# EAGLE schematic kulgurpower2-unrouted (EAGLE 6.3)

## Sheet 1 of 6
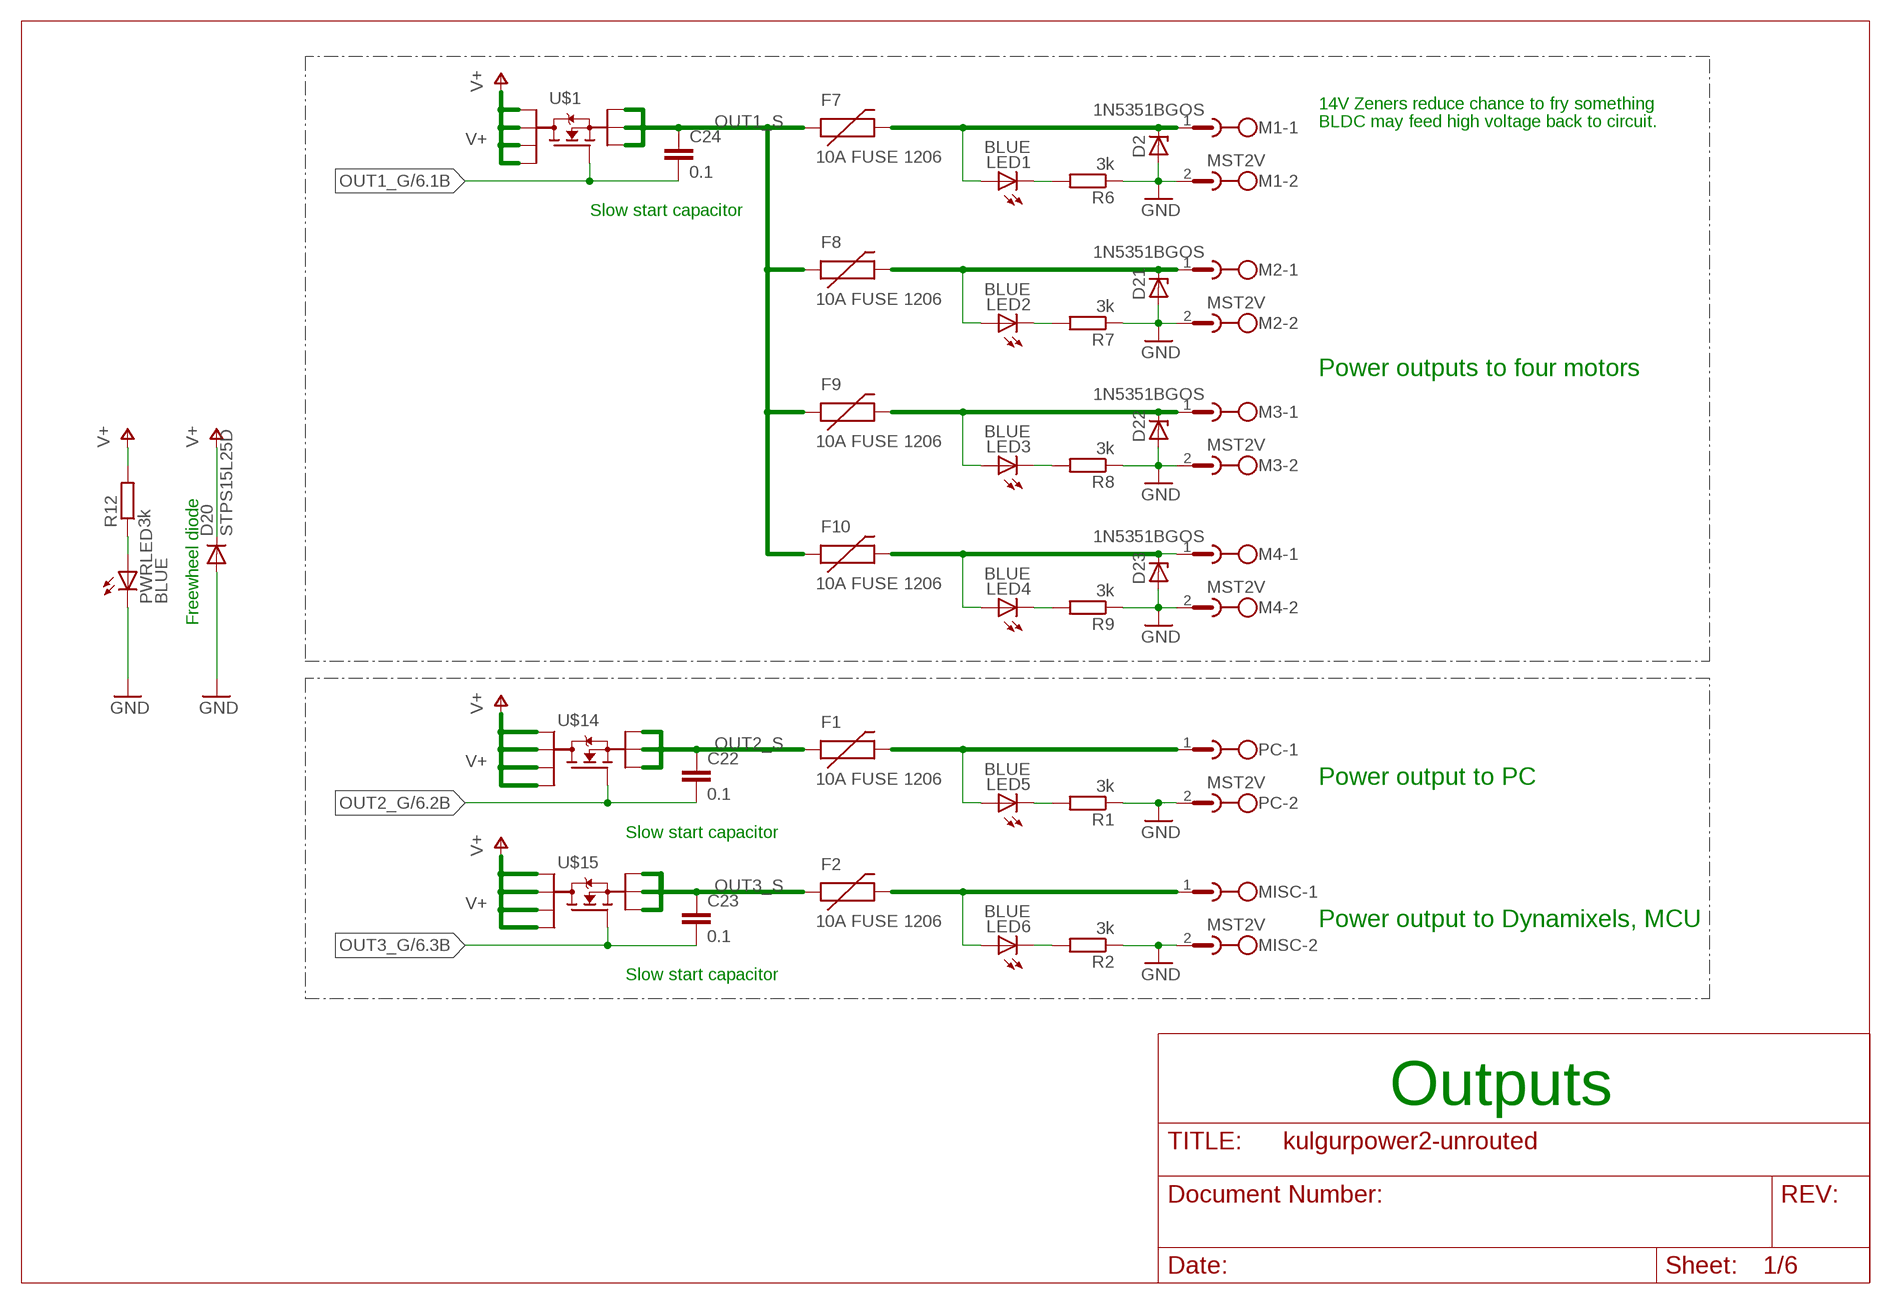
[diagram p0: schematic, sheet 1]

### Parts
C22  0.1  C-EUC0603  [C0603]
C23  0.1  C-EUC0603  [C0603]
C24  0.1  C-EUC0603  [C0603]
D2  1N5351BGOS  1N5333  [C1702-15]
D20  STPS15L25D  DIODE-C221B1A  [C221B1A]
D21  1N5351BGOS  1N5333  [C1702-15]
D22  1N5351BGOS  1N5333  [C1702-15]
D23  1N5351BGOS  1N5333  [C1702-15]
F1  10A FUSE 1206  PTCSMD  [PTC-1206]
F2  10A FUSE 1206  PTCSMD  [PTC-1206]
F7  10A FUSE 1206  PTCSMD  [PTC-1206]
F8  10A FUSE 1206  PTCSMD  [PTC-1206]
F9  10A FUSE 1206  PTCSMD  [PTC-1206]
F10  10A FUSE 1206  PTCSMD  [PTC-1206]
LED1  BLUE  LEDCHIP-LED0603  [CHIP-LED0603]
LED2  BLUE  LEDCHIP-LED0603  [CHIP-LED0603]
LED3  BLUE  LEDCHIP-LED0603  [CHIP-LED0603]
LED4  BLUE  LEDCHIP-LED0603  [CHIP-LED0603]
LED5  BLUE  LEDCHIP-LED0603  [CHIP-LED0603]
LED6  BLUE  LEDCHIP-LED0603  [CHIP-LED0603]
M1  MST2V  [MSTBV2]
M2  MST2V  [MSTBV2]
M3  MST2V  [MSTBV2]
M4  MST2V  [MSTBV2]
MISC  MST2V  [MSTBV2]
PC  MST2V  [MSTBV2]
PWRLED  BLUE  LEDCHIP-LED0603  [CHIP-LED0603]
R1  3k  R-EU_R0603  [R0603]
R2  3k  R-EU_R0603  [R0603]
R6  3k  R-EU_R0603  [R0603]
R7  3k  R-EU_R0603  [R0603]
R8  3k  R-EU_R0603  [R0603]
R9  3k  R-EU_R0603  [R0603]
R12  3k  R-EU_R0603  [R0603]
U$1  AON6500  FDMS8558S  [POWER56]
U$14  AON6500  FDMS8558S  [POWER56]
U$15  AON6500  FDMS8558S  [POWER56]

### Nets
GND: D2.A D20.A D21.A D22.A D23.A M1.2 M2.2 M3.2 M4.2 MISC.2 PC.2 PWRLED.C R1.1 R2.1 R6.1 R7.1 R8.1 R9.1 ; also sheet 2,3,4,5,6
N$1 [morepower]: LED1.C R6.2
N$4 [morepower]: LED2.C R7.2
N$7 [morepower]: LED3.C R8.2
N$9 [morepower]: LED4.C R9.2
N$15 [morepower]: LED5.C R1.2
N$17 [morepower]: LED6.C R2.2
N$19 [morepower]: PWRLED.A R12.1
OUT1_G [power]: C24.2 U$1.P$4(G) ; also sheet 6
OUT1_S [morepower]: C24.1 F7.1 F8.1 F9.1 F10.1 U$1.P$1(S1) U$1.P$2(S2) U$1.P$3(S3) ; also sheet 6
OUT2_G [power]: C22.2 U$14.P$4(G) ; also sheet 6
OUT2_S [morepower]: C22.1 F1.1 U$14.P$1(S1) U$14.P$2(S2) U$14.P$3(S3) ; also sheet 6
OUT3_G [power]: C23.2 U$15.P$4(G) ; also sheet 6
OUT3_S [morepower]: C23.1 F2.1 U$15.P$1(S1) U$15.P$2(S2) U$15.P$3(S3) ; also sheet 6
PWR1 [morepower]: D2.C F7.2 LED1.A M1.1
PWR2 [morepower]: D21.C F8.2 LED2.A M2.1
PWR3 [morepower]: D22.C F9.2 LED3.A M3.1
PWR4 [morepower]: D23.C F10.2 LED4.A M4.1
PWR5 [morepower]: F1.2 LED5.A PC.1
PWR6 [morepower]: F2.2 LED6.A MISC.1
V+ [morepower]: D20.C R12.2 U$1.P$5(D4) U$1.P$6(D3) U$1.P$7(D2) U$1.P$8(D1) U$14.P$5(D4) U$14.P$6(D3) U$14.P$7(D2) U$14.P$8(D1) U$15.P$5(D4) U$15.P$6(D3) U$15.P$7(D2) U$15.P$8(D1) ; also sheet 2,4,5,6

### Notes on the sheet
- 14V Zeners reduce chance to fry something
- BLDC may feed high voltage back to circuit.
- Slow start capacitor
- Power outputs to four motors
- Freewheel diode
- Power output to PC
- Slow start capacitor
- Power output to Dynamixels, MCU
- Slow start capacitor
- Outputs

## Sheet 2 of 6
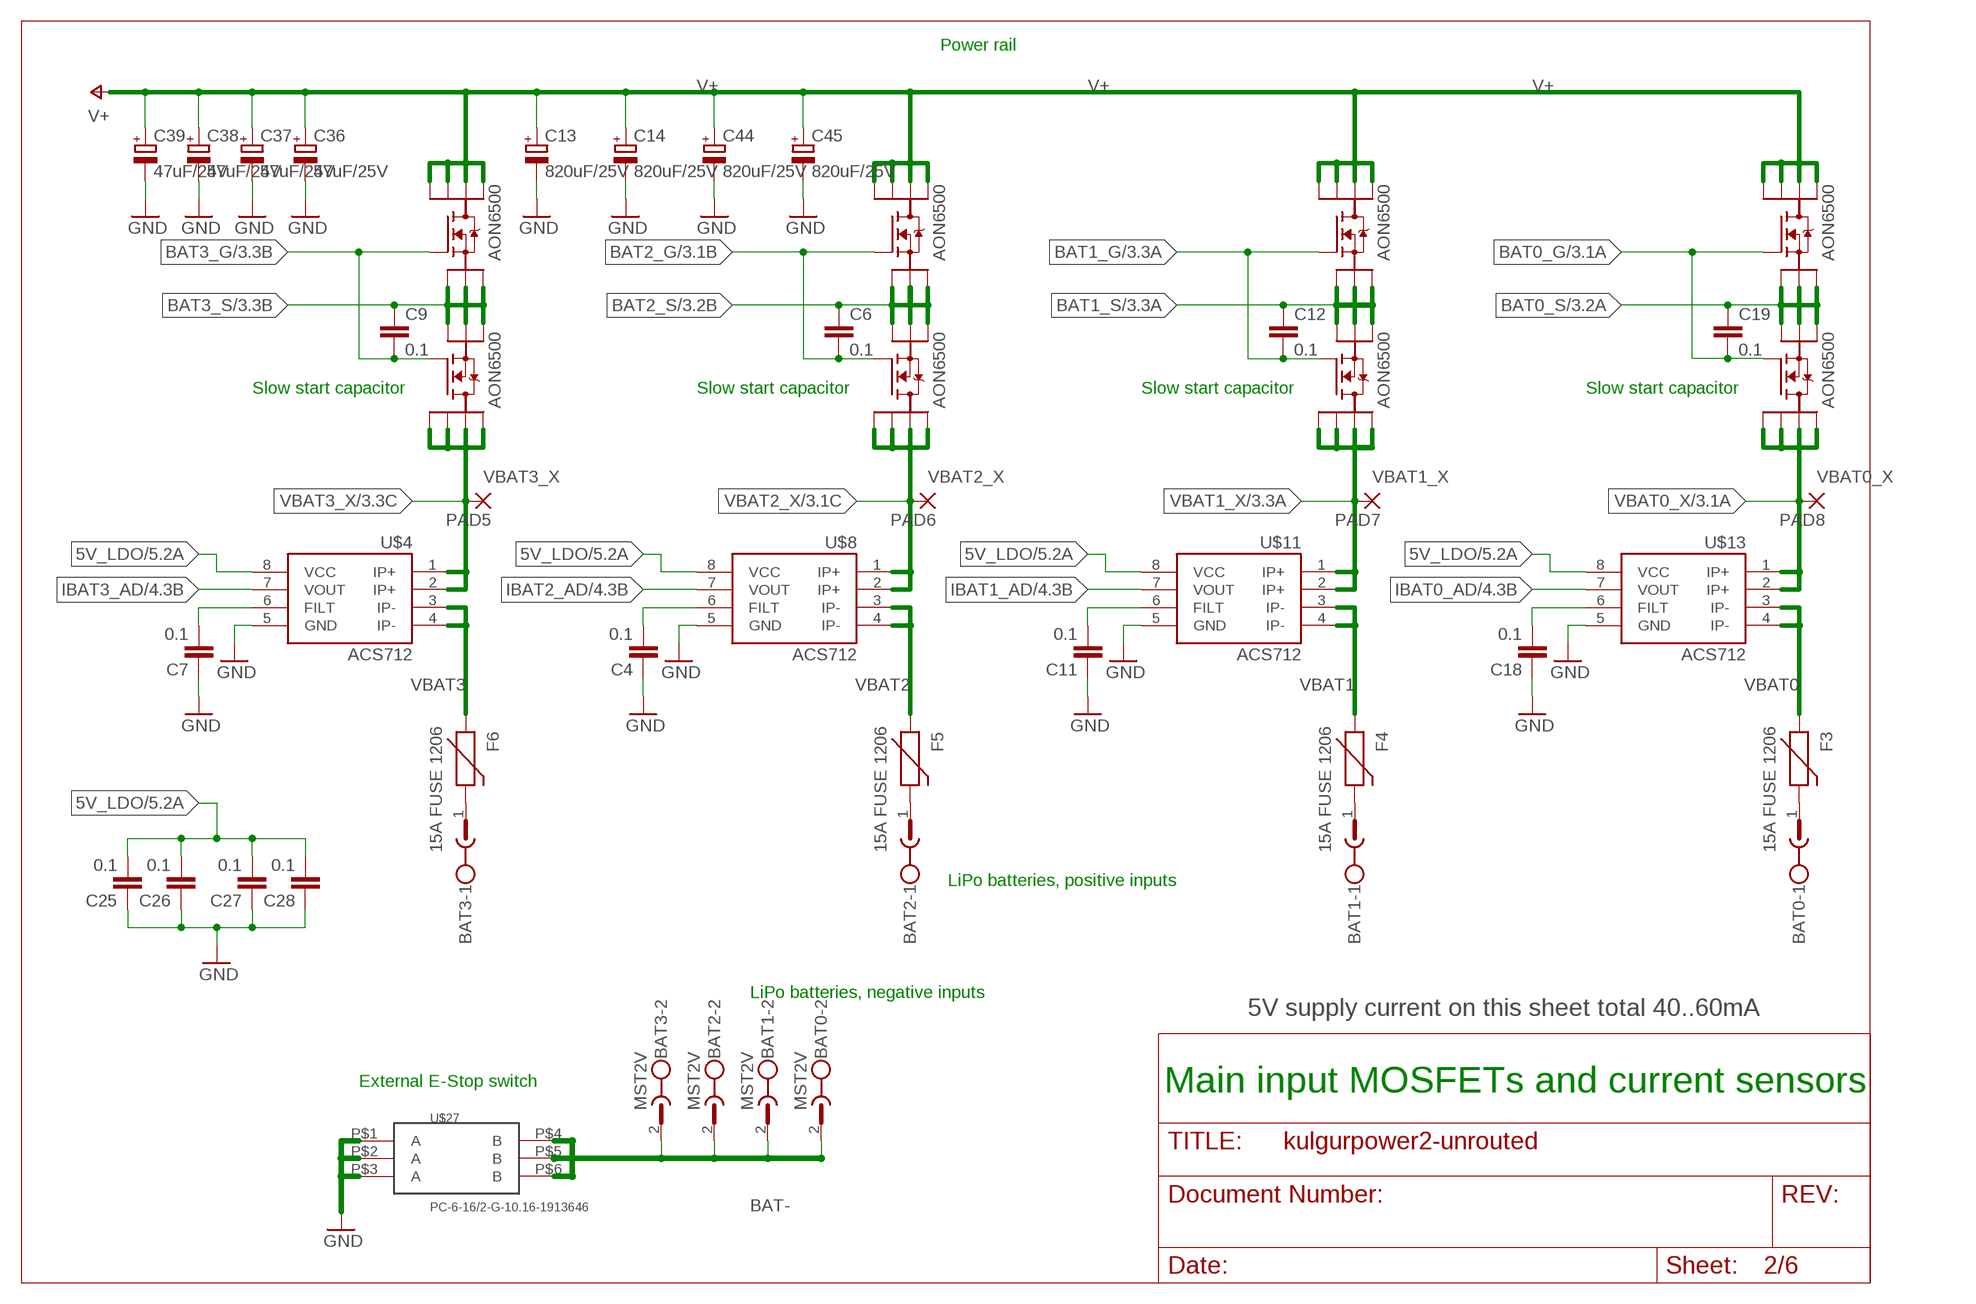
[diagram p1: schematic, sheet 2]

### Parts
BAT0  MST2V  [MSTBV2]
BAT1  MST2V  [MSTBV2]
BAT2  MST2V  [MSTBV2]
BAT3  MST2V  [MSTBV2]
C4  0.1  C-EUC0603  [C0603]
C6  0.1  C-EUC0603  [C0603]
C7  0.1  C-EUC0603  [C0603]
C9  0.1  C-EUC0603  [C0603]
C11  0.1  C-EUC0603  [C0603]
C12  0.1  C-EUC0603  [C0603]
C13  820uF/25V  CPOL-EU153CLV-1014  [153CLV-1014]
C14  820uF/25V  CPOL-EU153CLV-1014  [153CLV-1014]
C18  0.1  C-EUC0603  [C0603]
C19  0.1  C-EUC0603  [C0603]
C25  0.1  C-EUC0603  [C0603]
C26  0.1  C-EUC0603  [C0603]
C27  0.1  C-EUC0603  [C0603]
C28  0.1  C-EUC0603  [C0603]
C36  47uF/25V  CPOL-EUC/6032-28R  [C/6032-28R]
C37  47uF/25V  CPOL-EUC/6032-28R  [C/6032-28R]
C38  47uF/25V  CPOL-EU175TMP-0810  [175TMP-0810]
C39  47uF/25V  CPOL-EU175TMP-0810  [175TMP-0810]
C44  820uF/25V  CPOL-EU153CLV-1014  [153CLV-1014]
C45  820uF/25V  CPOL-EU153CLV-1014  [153CLV-1014]
F3  15A FUSE 1206  PTCSMD  [PTC-1206]
F4  15A FUSE 1206  PTCSMD  [PTC-1206]
F5  15A FUSE 1206  PTCSMD  [PTC-1206]
F6  15A FUSE 1206  PTCSMD  [PTC-1206]
PAD5  1,6/0,9  [1,6/0,9]
PAD6  1,6/0,9  [1,6/0,9]
PAD7  1,6/0,9  [1,6/0,9]
PAD8  1,6/0,9  [1,6/0,9]
U$2  AON6500  FDMS8558S  [POWER56]
U$3  AON6500  FDMS8558S  [POWER56]
U$4  ACS712  [SO08]
U$5  AON6500  FDMS8558S  [POWER56]
U$6  AON6500  FDMS8558S  [POWER56]
U$7  AON6500  FDMS8558S  [POWER56]
U$8  ACS712  [SO08]
U$9  AON6500  FDMS8558S  [POWER56]
U$10  AON6500  FDMS8558S  [POWER56]
U$11  ACS712  [SO08]
U$12  AON6500  FDMS8558S  [POWER56]
U$13  ACS712  [SO08]
U$27  PC-6-16/2-G-10.16-1913646  [PC-6-16/2-G-10.16]

### Nets
5V_LDO [power]: C25.2 C26.2 C27.2 C28.2 U$4.8(VCC) U$8.8(VCC) U$11.8(VCC) U$13.8(VCC) ; also sheet 5
BAT0_G [power]: C19.2 U$5.P$4(G) U$12.P$4(G) ; also sheet 3
BAT0_S [power]: C19.1 U$5.P$1(S1) U$5.P$2(S2) U$5.P$3(S3) U$12.P$1(S1) U$12.P$2(S2) U$12.P$3(S3) ; also sheet 3
BAT1_G [power]: C12.2 U$9.P$4(G) U$10.P$4(G) ; also sheet 3
BAT1_S [power]: C12.1 U$9.P$1(S1) U$9.P$2(S2) U$9.P$3(S3) U$10.P$1(S1) U$10.P$2(S2) U$10.P$3(S3) ; also sheet 3
BAT2_G [power]: C6.2 U$6.P$4(G) U$7.P$4(G) ; also sheet 3
BAT2_S [power]: C6.1 U$6.P$1(S1) U$6.P$2(S2) U$6.P$3(S3) U$7.P$1(S1) U$7.P$2(S2) U$7.P$3(S3) ; also sheet 3
BAT3_G [power]: C9.2 U$2.P$4(G) U$3.P$4(G) ; also sheet 3
BAT3_S [power]: C9.1 U$2.P$1(S1) U$2.P$2(S2) U$2.P$3(S3) U$3.P$1(S1) U$3.P$2(S2) U$3.P$3(S3) ; also sheet 3
BAT- [morepower]: BAT0.2 BAT1.2 BAT2.2 BAT3.2 U$27.P$4(B) U$27.P$5(B) U$27.P$6(B)
GND: C4.1 C7.1 C11.1 C13.- C14.- C18.1 C25.1 C26.1 C27.1 C28.1 C36.- C37.- C38.- C39.- C44.- C45.- U$4.5(GND) U$8.5(GND) U$11.5(GND) U$13.5(GND) U$27.P$1(A) U$27.P$2(A) U$27.P$3(A) ; also sheet 1,3,4,5,6
IBAT0_AD [power]: U$13.7(VOUT) ; also sheet 4
IBAT1_AD [power]: U$11.7(VOUT) ; also sheet 4
IBAT2_AD [power]: U$8.7(VOUT) ; also sheet 4
IBAT3_AD [power]: U$4.7(VOUT) ; also sheet 4
N$3: BAT0.1 F3.2
N$8: BAT3.1 F6.2
N$10: BAT1.1 F4.2
N$11 [power]: C4.2 U$8.6(FILT)
N$12: BAT2.1 F5.2
N$14 [power]: C11.2 U$11.6(FILT)
N$21 [power]: C7.2 U$4.6(FILT)
N$27 [power]: C18.2 U$13.6(FILT)
V+ [morepower]: C13.+ C14.+ C36.+ C37.+ C38.+ C39.+ C44.+ C45.+ U$2.P$5(D4) U$2.P$6(D3) U$2.P$7(D2) U$2.P$8(D1) U$5.P$5(D4) U$5.P$6(D3) U$5.P$7(D2) U$5.P$8(D1) U$6.P$5(D4) U$6.P$6(D3) U$6.P$7(D2) U$6.P$8(D1) U$9.P$5(D4) U$9.P$6(D3) U$9.P$7(D2) U$9.P$8(D1) ; also sheet 1,4,5,6
VBAT0 [morepower]: F3.1 U$13.3(IP-) U$13.4(IP-)
VBAT0_X [morepower]: PAD8.1(P) U$12.P$5(D4) U$12.P$6(D3) U$12.P$7(D2) U$12.P$8(D1) U$13.1(IP+) U$13.2(IP+) ; also sheet 3,4
VBAT1 [morepower]: F4.1 U$11.3(IP-) U$11.4(IP-)
VBAT1_X [morepower]: PAD7.1(P) U$10.P$5(D4) U$10.P$6(D3) U$10.P$7(D2) U$10.P$8(D1) U$11.1(IP+) U$11.2(IP+) ; also sheet 3,4
VBAT2 [morepower]: F5.1 U$8.3(IP-) U$8.4(IP-)
VBAT2_X [morepower]: PAD6.1(P) U$7.P$5(D4) U$7.P$6(D3) U$7.P$7(D2) U$7.P$8(D1) U$8.1(IP+) U$8.2(IP+) ; also sheet 3,4
VBAT3 [morepower]: F6.1 U$4.3(IP-) U$4.4(IP-)
VBAT3_X [morepower]: PAD5.1(P) U$3.P$5(D4) U$3.P$6(D3) U$3.P$7(D2) U$3.P$8(D1) U$4.1(IP+) U$4.2(IP+) ; also sheet 3,4

### Notes on the sheet
- Power rail
- Slow start capacitor | Slow start capacitor | Slow start capacitor | Slow start capacitor
- LiPo batteries, positive inputs
- LiPo batteries, negative inputs
- 5V supply current on this sheet total 40..60mA
- External E-Stop switch
- Main input MOSFETs and current sensors

## Sheet 3 of 6
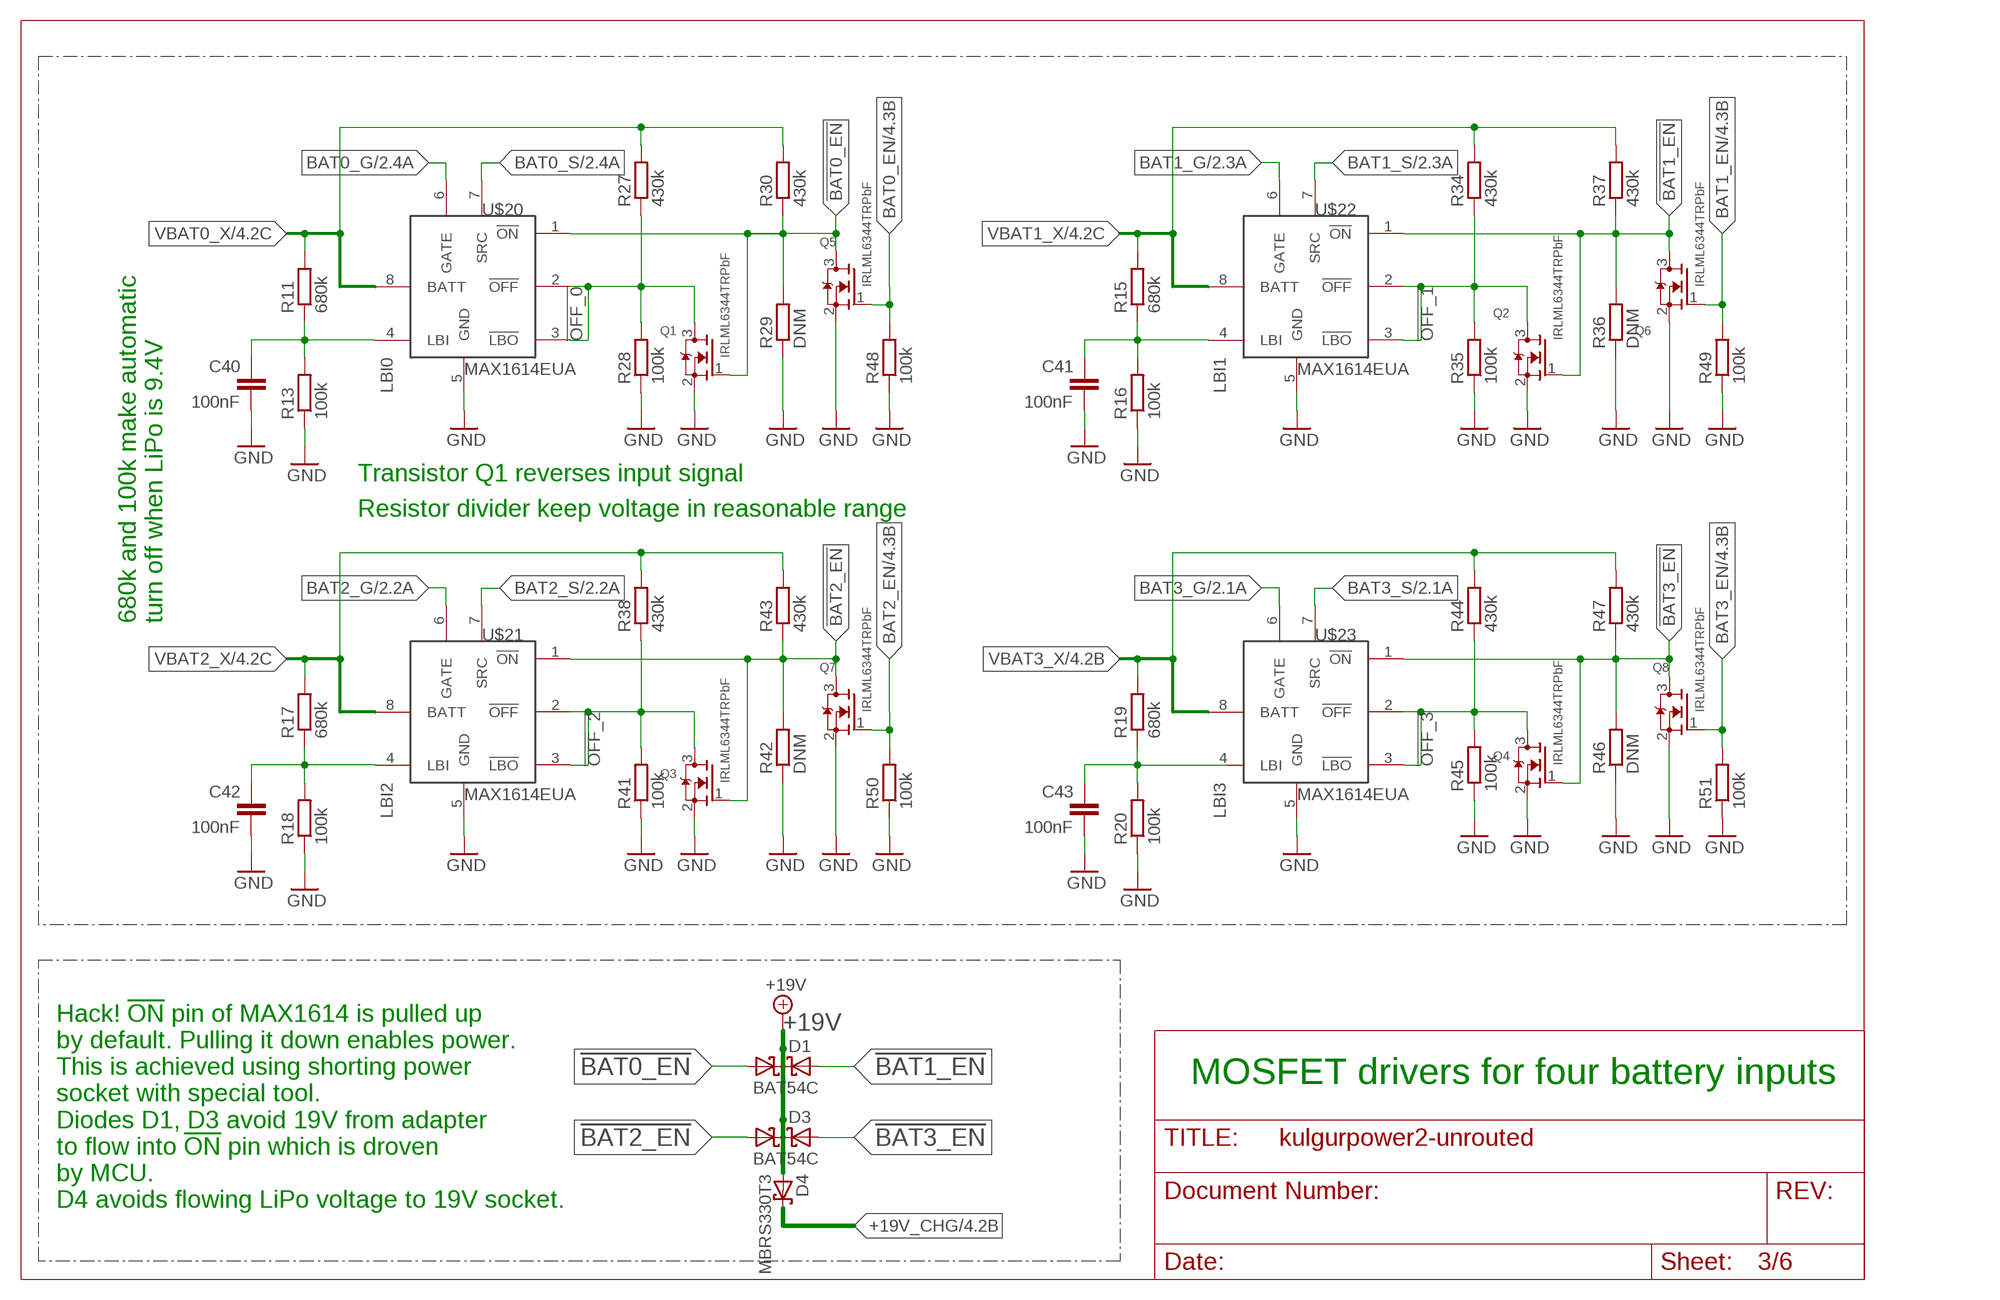
[diagram p2: schematic, sheet 3]

### Parts
C40  100nF  C-EUC0603  [C0603]
C41  100nF  C-EUC0603  [C0603]
C42  100nF  C-EUC0603  [C0603]
C43  100nF  C-EUC0603  [C0603]
D1  BAT54C  [SOT23]
D3  BAT54C  [SOT23]
D4  MBRS330T3  [SMC]
Q1  IRLML6344TRPbF  MOSFET-NREFLOW  [SOT23]
Q2  IRLML6344TRPbF  MOSFET-NREFLOW  [SOT23]
Q3  IRLML6344TRPbF  MOSFET-NREFLOW  [SOT23]
Q4  IRLML6344TRPbF  MOSFET-NREFLOW  [SOT23]
Q5  IRLML6344TRPbF  MOSFET-NREFLOW  [SOT23]
Q6  IRLML6344TRPbF  MOSFET-NREFLOW  [SOT23]
Q7  IRLML6344TRPbF  MOSFET-NREFLOW  [SOT23]
Q8  IRLML6344TRPbF  MOSFET-NREFLOW  [SOT23]
R11  680k  R-EU_R0603  [R0603]
R13  100k  R-EU_R0603  [R0603]
R15  680k  R-EU_R0603  [R0603]
R16  100k  R-EU_R0603  [R0603]
R17  680k  R-EU_R0603  [R0603]
R18  100k  R-EU_R0603  [R0603]
R19  680k  R-EU_R0603  [R0603]
R20  100k  R-EU_R0603  [R0603]
R27  430k  R-EU_R0603  [R0603]
R28  100k  R-EU_R0603  [R0603]
R29  DNM  R-EU_R0603  [R0603]
R30  430k  R-EU_R0603  [R0603]
R34  430k  R-EU_R0603  [R0603]
R35  100k  R-EU_R0603  [R0603]
R36  DNM  R-EU_R0603  [R0603]
R37  430k  R-EU_R0603  [R0603]
R38  430k  R-EU_R0603  [R0603]
R41  100k  R-EU_R0603  [R0603]
R42  DNM  R-EU_R0603  [R0603]
R43  430k  R-EU_R0603  [R0603]
R44  430k  R-EU_R0603  [R0603]
R45  100k  R-EU_R0603  [R0603]
R46  DNM  R-EU_R0603  [R0603]
R47  430k  R-EU_R0603  [R0603]
R48  100k  R-EU_R0603  [R0603]
R49  100k  R-EU_R0603  [R0603]
R50  100k  R-EU_R0603  [R0603]
R51  100k  R-EU_R0603  [R0603]
U$20  MAX1614EUA  [MAX1614EUA]
U$21  MAX1614EUA  [MAX1614EUA]
U$22  MAX1614EUA  [MAX1614EUA]
U$23  MAX1614EUA  [MAX1614EUA]

### Nets
!BAT0_EN [power]: D1.1(A1) Q1.1(G) Q5.3(D) R29.2 R30.1 U$20.1(!ON)
!BAT1_EN [power]: D1.2(A2) Q2.1(G) Q6.3(D) R36.2 R37.1 U$22.1(!ON)
!BAT2_EN [power]: D3.1(A1) Q3.1(G) Q7.3(D) R42.2 R43.1 U$21.1(!ON)
!BAT3_EN [power]: D3.2(A2) Q4.1(G) Q8.3(D) R46.2 R47.1 U$23.1(!ON)
!OFF_0 [morepower]: Q1.3(D) R27.1 R28.2 U$20.2(!OFF) U$20.3(!LBO)
!OFF_1 [morepower]: Q2.3(D) R34.1 R35.2 U$22.2(!OFF) U$22.3(!LBO)
!OFF_2 [morepower]: Q3.3(D) R38.1 R41.2 U$21.2(!OFF) U$21.3(!LBO)
!OFF_3 [morepower]: Q4.3(D) R44.1 R45.2 U$23.2(!OFF) U$23.3(!LBO)
+19V [morepower]: D1.3(CC) D3.3(CC) D4.A ; also sheet 4
+19V_CHG: D4.C ; also sheet 4
BAT0_EN [power]: Q5.1(G) R48.2 ; also sheet 4
BAT0_G [power]: U$20.6(GATE) ; also sheet 2
BAT0_S [power]: U$20.7(SRC) ; also sheet 2
BAT1_EN [power]: Q6.1(G) R49.2 ; also sheet 4
BAT1_G [power]: U$22.6(GATE) ; also sheet 2
BAT1_S [power]: U$22.7(SRC) ; also sheet 2
BAT2_EN [power]: Q7.1(G) R50.2 ; also sheet 4
BAT2_G [power]: U$21.6(GATE) ; also sheet 2
BAT2_S [power]: U$21.7(SRC) ; also sheet 2
BAT3_EN [power]: Q8.1(G) R51.2 ; also sheet 4
BAT3_G [power]: U$23.6(GATE) ; also sheet 2
BAT3_S [power]: U$23.7(SRC) ; also sheet 2
GND: C40.2 C41.2 C42.2 C43.2 Q1.2(S) Q2.2(S) Q3.2(S) Q4.2(S) Q5.2(S) Q6.2(S) Q7.2(S) Q8.2(S) R13.1 R16.1 R18.1 R20.1 R28.1 R29.1 R35.1 R36.1 R41.1 R42.1 R45.1 R46.1 R48.1 R49.1 R50.1 R51.1 U$20.5(GND) U$21.5(GND) U$22.5(GND) U$23.5(GND) ; also sheet 1,2,4,5,6
LBI0 [morepower]: C40.1 R11.1 R13.2 U$20.4(LBI)
LBI1 [morepower]: C41.1 R15.1 R16.2 U$22.4(LBI)
LBI2 [morepower]: C42.1 R17.1 R18.2 U$21.4(LBI)
LBI3 [morepower]: C43.1 R19.1 R20.2 U$23.4(LBI)
VBAT0_X [morepower]: R11.2 R27.2 R30.2 U$20.8(BATT) ; also sheet 2,4
VBAT1_X [morepower]: R15.2 R34.2 R37.2 U$22.8(BATT) ; also sheet 2,4
VBAT2_X [morepower]: R17.2 R38.2 R43.2 U$21.8(BATT) ; also sheet 2,4
VBAT3_X [morepower]: R19.2 R44.2 R47.2 U$23.8(BATT) ; also sheet 2,4

### Notes on the sheet
- Transistor Q1 reverses input signal
- Resistor divider keep voltage in reasonable range
- 680k and 100k make automatic 
  turn off when LiPo is 9.4V
- MOSFET drivers for four battery inputs
- Hack! !ON! pin of MAX1614 is pulled up 
  by default. Pulling it down enables power. 
  This is achieved using shorting power
  socket with special tool.
  Diodes D1, D3 avoid 19V from adapter 
  to flow into !ON! pin which is droven 
  by MCU.
  D4 avoids flowing LiPo voltage to 19V socket.

## Sheet 4 of 6
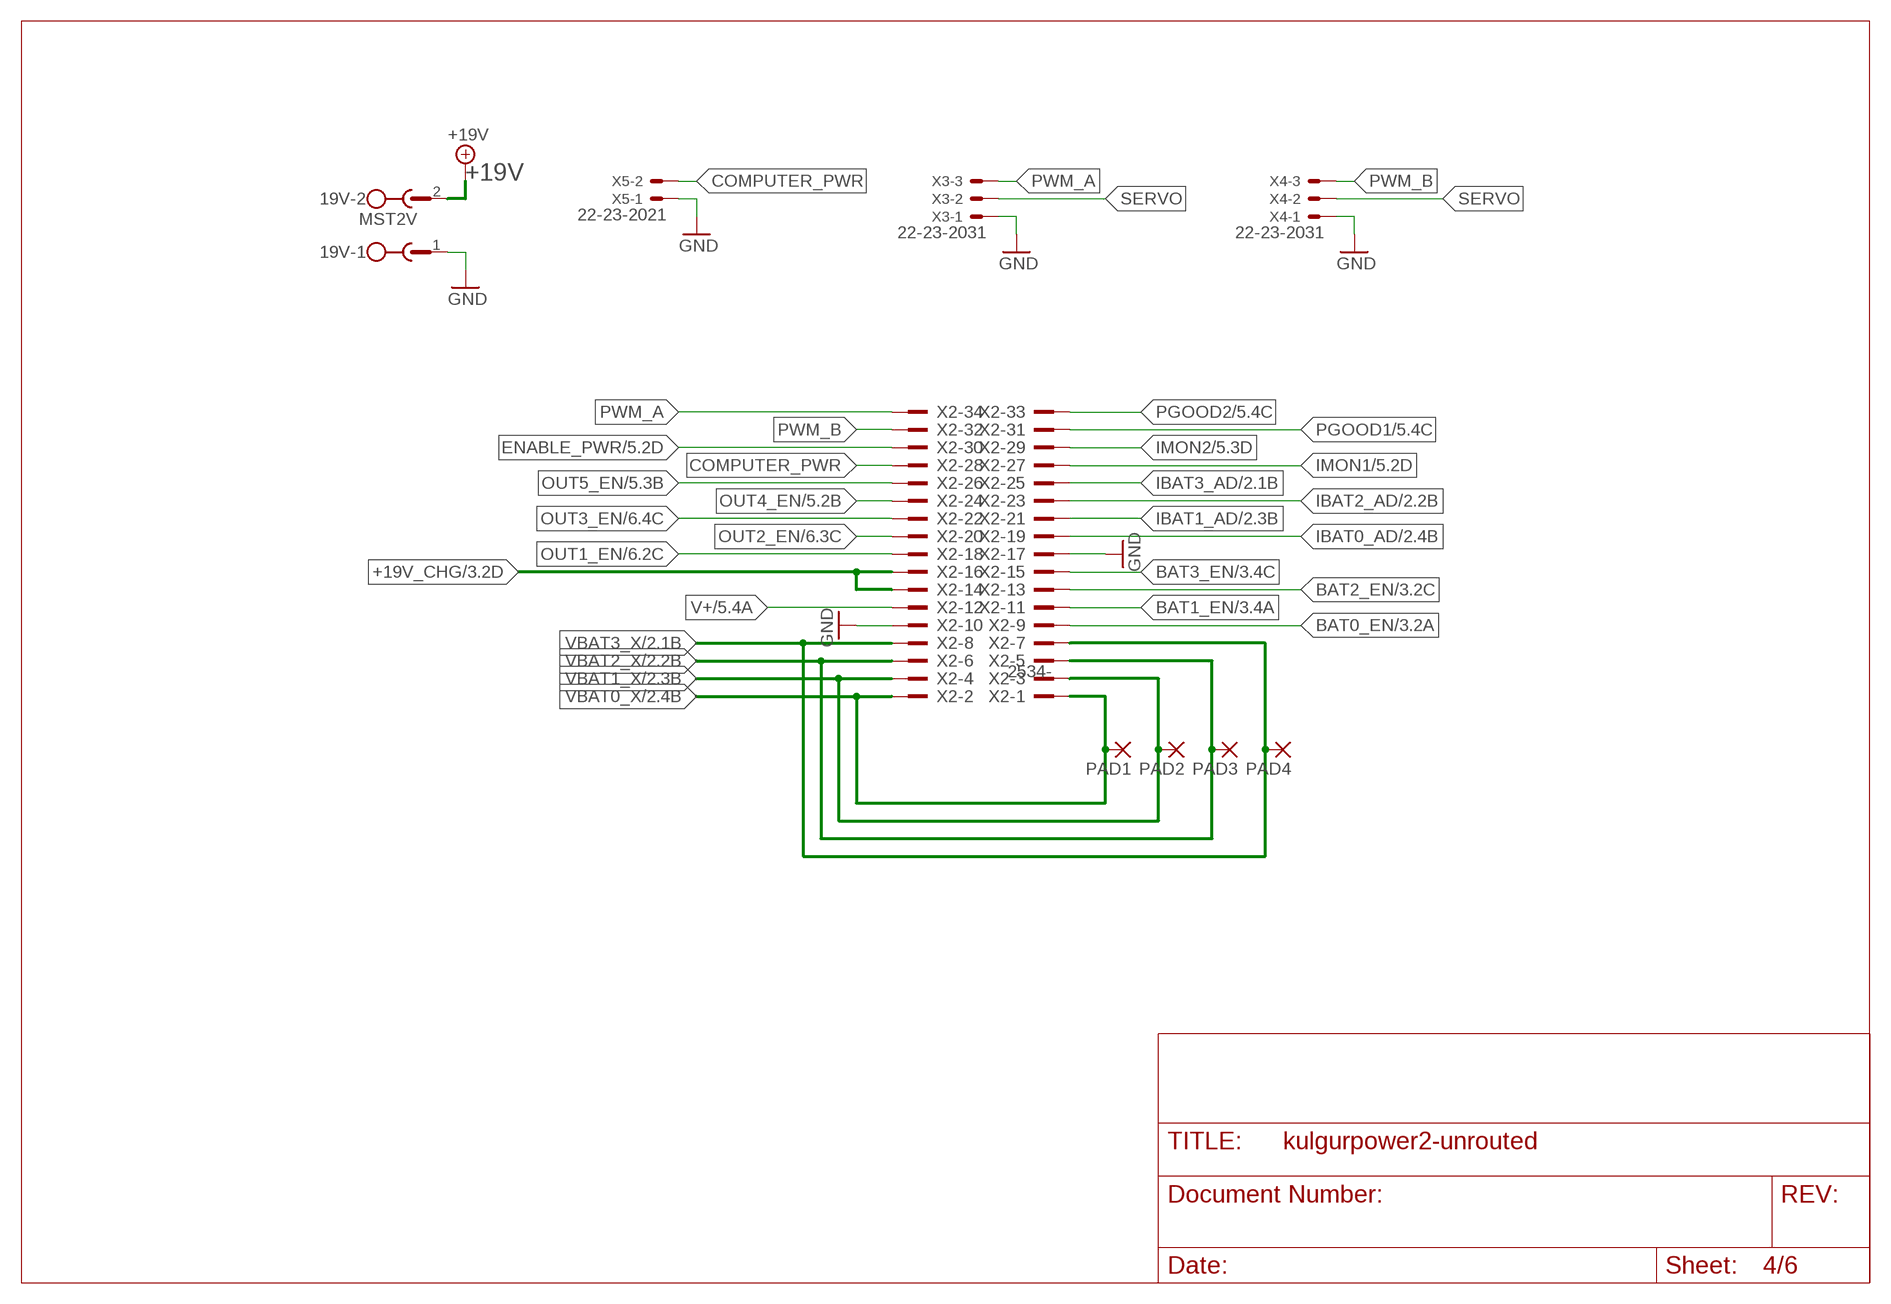
[diagram p3: schematic, sheet 4]

### Parts
19V  MST2V  [MSTBV2]
PAD1  1,6/0,9  [1,6/0,9]
PAD2  1,6/0,9  [1,6/0,9]
PAD3  1,6/0,9  [1,6/0,9]
PAD4  1,6/0,9  [1,6/0,9]
X2  2534-  [PAK100/2500-34]
X3  22-23-2031  [22-23-2031]
X4  22-23-2031  [22-23-2031]
X5  22-23-2021  [22-23-2021]

### Nets
+19V [morepower]: 19V.2 ; also sheet 3
+19V_CHG: X2.14 X2.16 ; also sheet 3
BAT0_EN [power]: X2.9 ; also sheet 3
BAT1_EN [power]: X2.11 ; also sheet 3
BAT2_EN [power]: X2.13 ; also sheet 3
BAT3_EN [power]: X2.15 ; also sheet 3
COMPUTER_PWR [power]: X2.28 X5.2
ENABLE_PWR: X2.30 ; also sheet 5
GND: 19V.1 X2.10 X2.17 X3.1 X4.1 X5.1 ; also sheet 1,2,3,5,6
IBAT0_AD [power]: X2.19 ; also sheet 2
IBAT1_AD [power]: X2.21 ; also sheet 2
IBAT2_AD [power]: X2.23 ; also sheet 2
IBAT3_AD [power]: X2.25 ; also sheet 2
IMON1: X2.27 ; also sheet 5
IMON2: X2.29 ; also sheet 5
OUT1_EN [power]: X2.18 ; also sheet 6
OUT2_EN [power]: X2.20 ; also sheet 6
OUT3_EN [power]: X2.22 ; also sheet 6
OUT4_EN: X2.24 ; also sheet 5
OUT5_EN: X2.26 ; also sheet 5
PGOOD1: X2.31 ; also sheet 5
PGOOD2: X2.33 ; also sheet 5
PWM_A [power]: X2.34 X3.3
PWM_B [power]: X2.32 X4.3
SERVO [morepower]: X3.2 X4.2 ; also sheet 5
V+ [morepower]: X2.12 ; also sheet 1,2,5,6
VBAT0_X [morepower]: PAD1.1(P) X2.1 X2.2 ; also sheet 2,3
VBAT1_X [morepower]: PAD2.1(P) X2.3 X2.4 ; also sheet 2,3
VBAT2_X [morepower]: PAD3.1(P) X2.5 X2.6 ; also sheet 2,3
VBAT3_X [morepower]: PAD4.1(P) X2.7 X2.8 ; also sheet 2,3

## Sheet 5 of 6
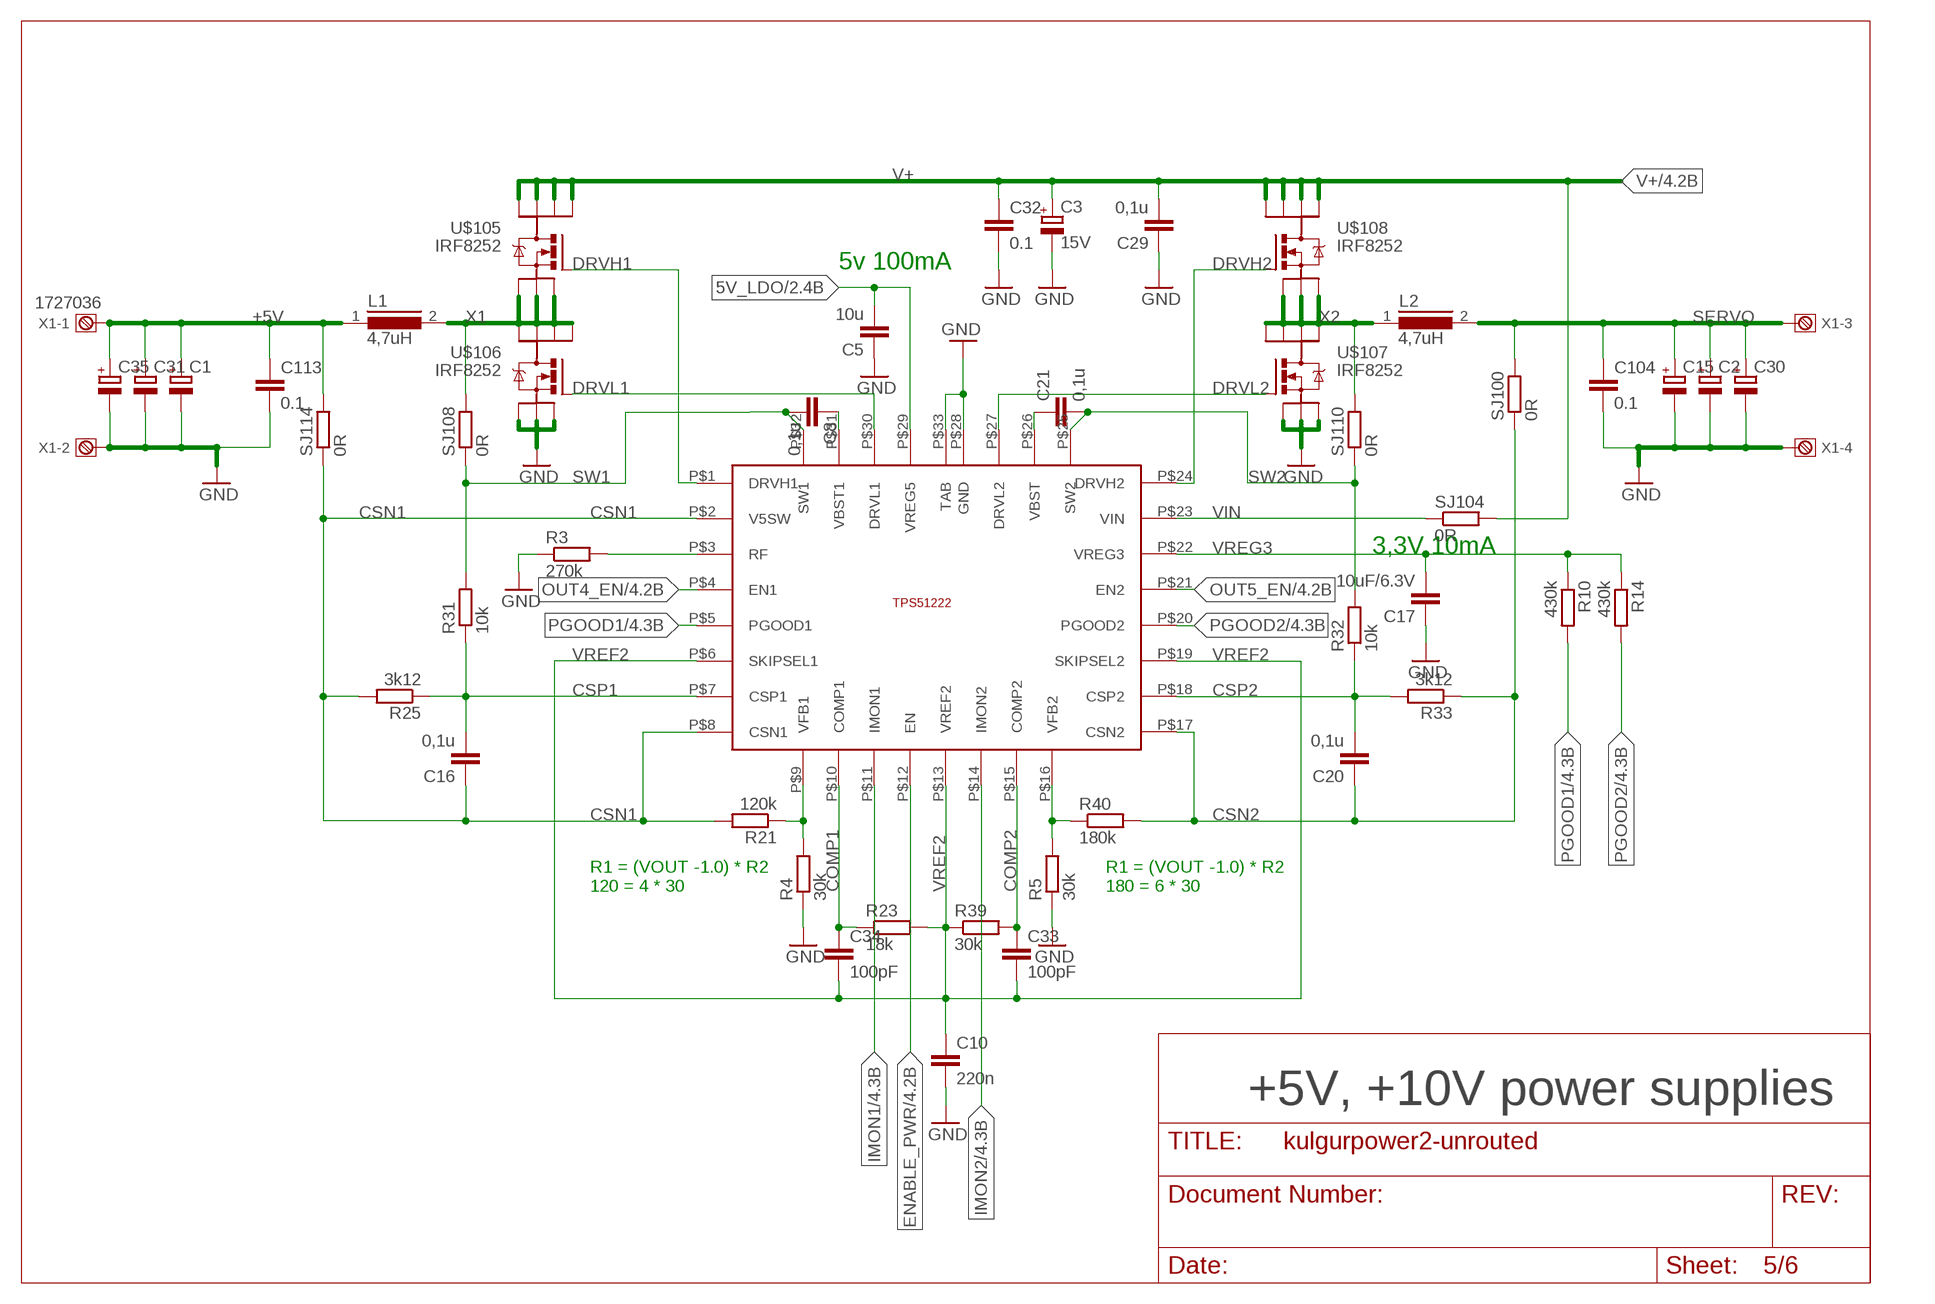
[diagram p4: schematic, sheet 5]

### Parts
C1  CPOL-EUC/6032-28R  [C/6032-28R]
C2  CPOL-EUC/6032-28R  [C/6032-28R]
C3  15V  CPOL-EUC/6032-28R  [C/6032-28R]
C5  10u  C-EUC1210  [C1210]
C8  0,1u  C-EUC0603  [C0603]
C10  220n  C-EUC0603  [C0603]
C15  CPOL-EUC/6032-28R  [C/6032-28R]
C16  0,1u  C-EUC0603  [C0603]
C17  10uF/6.3V  C-EUC1210  [C1210]
C20  0,1u  C-EUC0603  [C0603]
C21  0,1u  C-EUC0603  [C0603]
C29  0,1u  C-EUC0603  [C0603]
C30  CPOL-EUC/6032-28R  [C/6032-28R]
C31  CPOL-EUC/6032-28R  [C/6032-28R]
C32  0.1  C-EUC0603  [C0603]
C33  100pF  CAP0805  [0805]
C34  100pF  CAP0805  [0805]
C35  CPOL-EUC/6032-28R  [C/6032-28R]
C104  0.1  C-EUC0603  [C0603]
C113  0.1  C-EUC0603  [C0603]
L1  4,7uH  DR125  [DR125]
L2  4,7uH  DR125  [DR125]
R3  270k  R-EU_R0603  [R0603]
R4  30k  R-EU_R0603  [R0603]
R5  30k  R-EU_R0603  [R0603]
R10  430k  R-EU_R0603  [R0603]
R14  430k  R-EU_R0603  [R0603]
R21  120k  R-EU_R0603  [R0603]
R23  18k  R-EU_R0603  [R0603]
R25  3k12  R-EU_R0603  [R0603]
R31  10k  R-EU_R0603  [R0603]
R32  10k  R-EU_R0603  [R0603]
R33  3k12  R-EU_R0603  [R0603]
R39  30k  R-EU_R0603  [R0603]
R40  180k  R-EU_R0603  [R0603]
SJ100  0R  R-EU_R0603  [R0603]
SJ104  0R  R-EU_R0603  [R0603]
SJ108  0R  R-EU_R0603  [R0603]
SJ110  0R  R-EU_R0603  [R0603]
SJ114  0R  R-EU_R0603  [R0603]
U$17  TPS51222RTVT  [QFN-32]
U$105  IRF8252  [SO8]
U$106  IRF8252  [SO8]
U$107  IRF8252  [SO8]
U$108  IRF8252  [SO8]
X1  1727036  [1727036]

### Nets
5V_LDO [power]: C5.2 U$17.P$29(VREG5) ; also sheet 2
+5V [morepower]: C1.+ C31.+ C35.+ C113.1 L1.1 SJ114.2 X1.1
COMP1: C34.1 R23.1 U$17.P$10(COMP1)
COMP2: C33.1 R39.2 U$17.P$15(COMP2)
CSN1: C16.1 R21.2 R25.2 SJ114.1 U$17.P$2(V5SW) U$17.P$8(CSN1)
CSN2: C20.1 R33.1 R40.2 SJ100.1 U$17.P$17(CSN2)
CSP1: C16.2 R25.1 R31.1 U$17.P$7(CSP1)
CSP2: C20.2 R32.1 R33.2 U$17.P$18(CSP2)
DRVH1: U$17.P$1(DRVH1) U$105.4(G)
DRVH2: U$17.P$24(DRVH2) U$108.4(G)
DRVL1: U$17.P$30(DRVL1) U$106.4(G)
DRVL2: U$17.P$27(DRVL2) U$107.4(G)
ENABLE_PWR: U$17.P$12(EN) ; also sheet 4
GND: C1.- C2.- C3.- C5.1 C10.2 C15.- C17.1 C29.1 C30.- C31.- C32.2 C35.- C104.2 C113.2 R3.1 R4.1 R5.1 U$17.P$28(GND) U$17.P$33(TAB) U$106.1(S) U$106.2(S) U$106.3(S) U$107.1(S) U$107.2(S) U$107.3(S) X1.2 X1.4 ; also sheet 1,2,3,4,6
IMON1: U$17.P$11(IMON1) ; also sheet 4
IMON2: U$17.P$14(IMON2) ; also sheet 4
N$5: R4.2 R21.1 U$17.P$9(VFB1)
N$18: R5.2 R40.1 U$17.P$16(VFB2)
N$24: R3.2 U$17.P$3(RF)
N$29: C8.1 U$17.P$31(VBST1)
N$30: C21.1 U$17.P$26(VBST)
OUT4_EN: U$17.P$4(EN1) ; also sheet 4
OUT5_EN: U$17.P$21(EN2) ; also sheet 4
PGOOD1: R10.2 U$17.P$5(PGOOD1) ; also sheet 4
PGOOD2: R14.2 U$17.P$20(PGOOD2) ; also sheet 4
SERVO [morepower]: C2.+ C15.+ C30.+ C104.1 L2.2 SJ100.2 X1.3 ; also sheet 4
SW1: C8.2 R31.2 SJ108.1 U$17.P$32(SW1)
SW2: C21.2 R32.2 SJ110.1 U$17.P$25(SW2)
V+ [morepower]: C3.+ C29.2 C32.1 SJ104.2 U$105.5(D) U$105.6(D) U$105.7(D) U$105.8(D) U$108.5(D) U$108.6(D) U$108.7(D) U$108.8(D) ; also sheet 1,2,4,6
VIN: SJ104.1 U$17.P$23(VIN)
VREF2: C10.1 C33.2 C34.2 R23.2 R39.1 U$17.P$6(SKIPSEL1) U$17.P$13(VREF2) U$17.P$19(SKIPSEL2)
VREG3: C17.2 R10.1 R14.1 U$17.P$22(VREG3)
X1 [morepower]: L1.2 SJ108.2 U$105.1(S) U$105.2(S) U$105.3(S) U$106.5(D) U$106.6(D) U$106.7(D) U$106.8(D)
X2 [morepower]: L2.1 SJ110.2 U$107.5(D) U$107.6(D) U$107.7(D) U$107.8(D) U$108.1(S) U$108.2(S) U$108.3(S)

### Notes on the sheet
- 5v 100mA
- 3,3V 10mA
- R1 = (VOUT -1.0) * R2
  120 = 4 * 30
- R1 = (VOUT -1.0) * R2
  180 = 6 * 30
- +5V, +10V power supplies

## Sheet 6 of 6
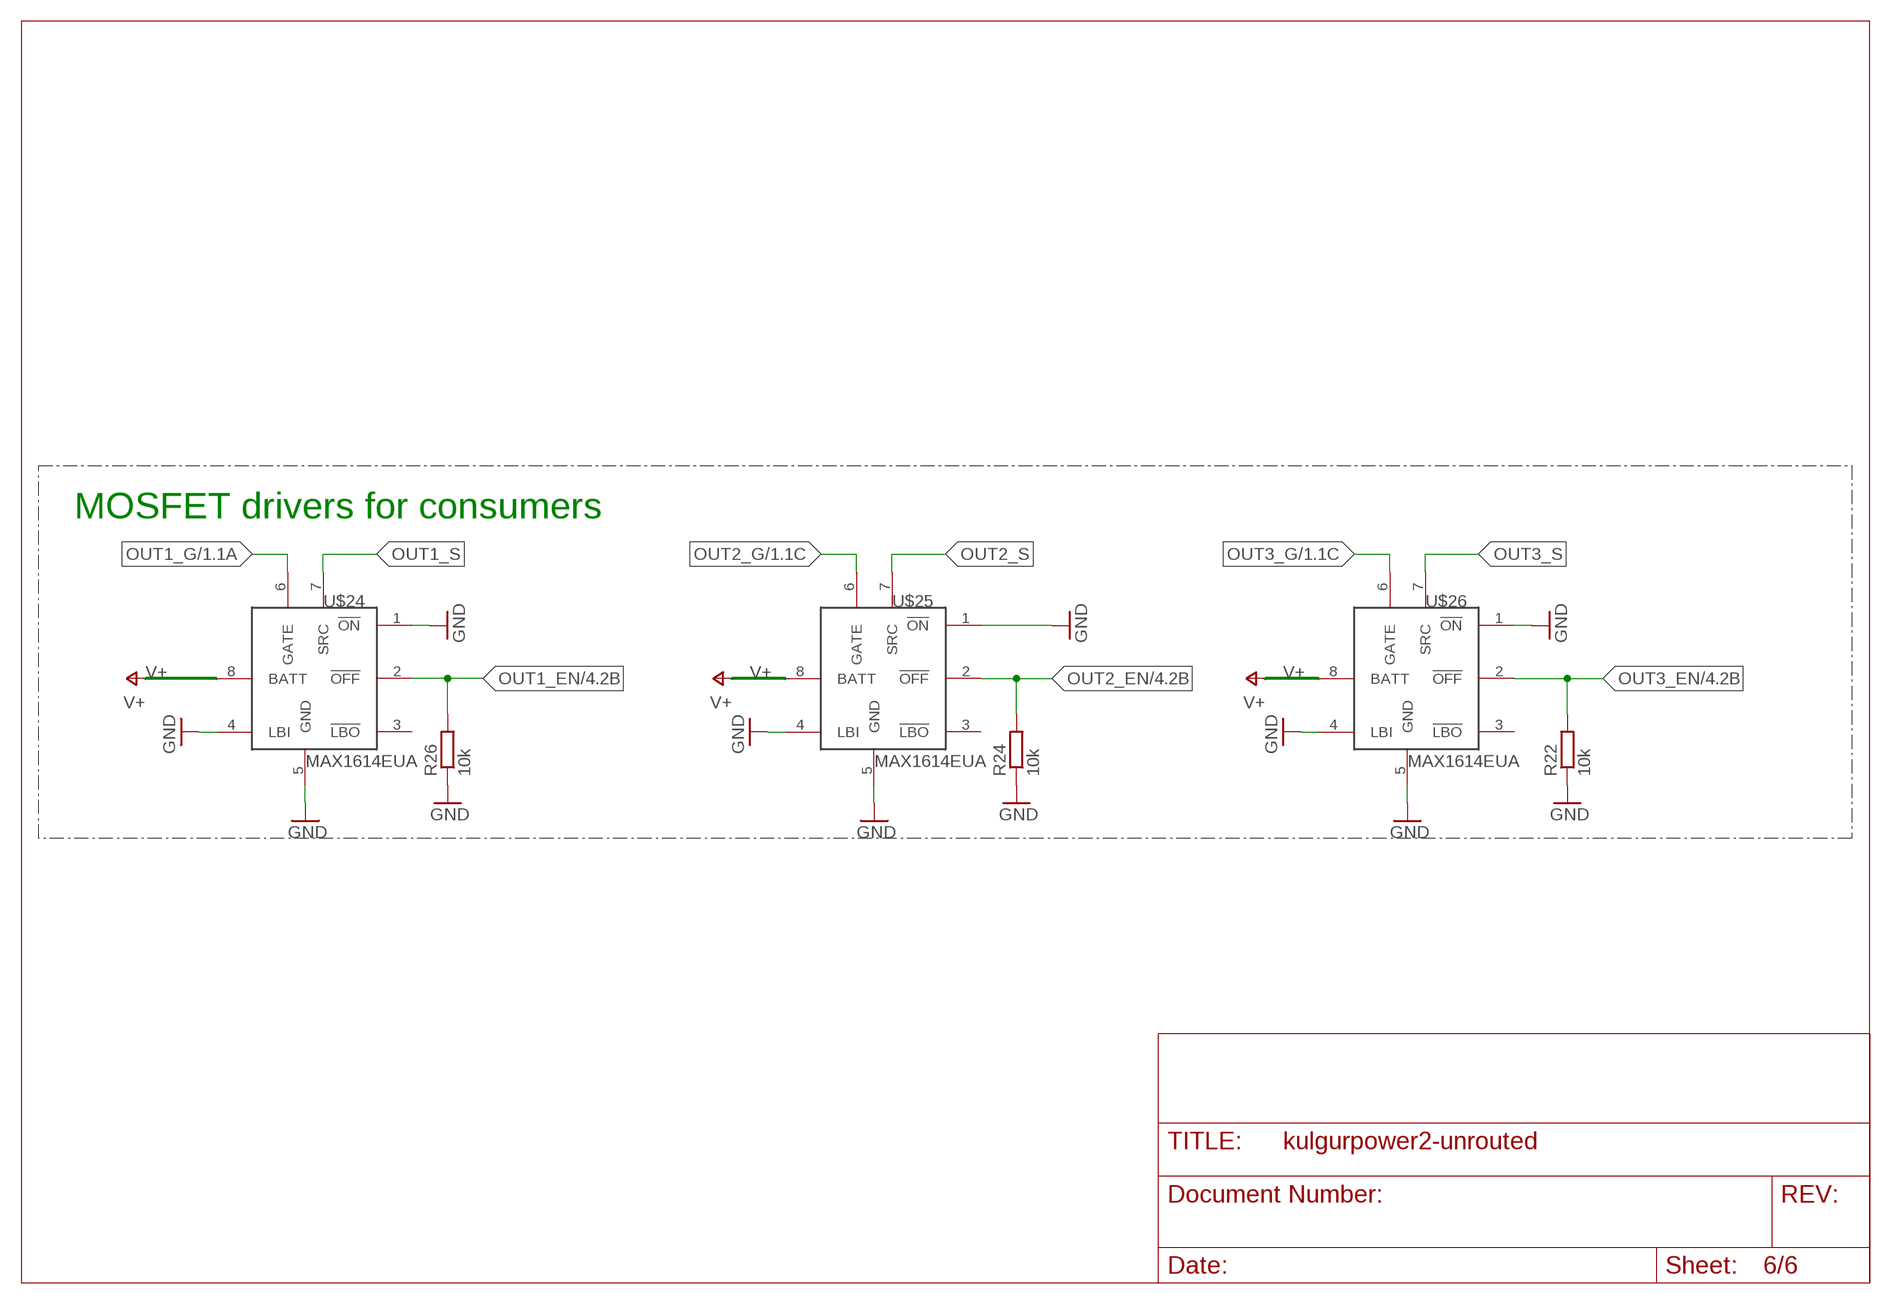
[diagram p5: schematic, sheet 6]

### Parts
R22  10k  R-EU_R0603  [R0603]
R24  10k  R-EU_R0603  [R0603]
R26  10k  R-EU_R0603  [R0603]
U$24  MAX1614EUA  [MAX1614EUA]
U$25  MAX1614EUA  [MAX1614EUA]
U$26  MAX1614EUA  [MAX1614EUA]

### Nets
GND: R22.1 R24.1 R26.1 U$24.1(!ON) U$24.4(LBI) U$24.5(GND) U$25.1(!ON) U$25.4(LBI) U$25.5(GND) U$26.1(!ON) U$26.4(LBI) U$26.5(GND) ; also sheet 1,2,3,4,5
OUT1_EN [power]: R26.2 U$24.2(!OFF) ; also sheet 4
OUT1_G [power]: U$24.6(GATE) ; also sheet 1
OUT1_S [morepower]: U$24.7(SRC) ; also sheet 1
OUT2_EN [power]: R24.2 U$25.2(!OFF) ; also sheet 4
OUT2_G [power]: U$25.6(GATE) ; also sheet 1
OUT2_S [morepower]: U$25.7(SRC) ; also sheet 1
OUT3_EN [power]: R22.2 U$26.2(!OFF) ; also sheet 4
OUT3_G [power]: U$26.6(GATE) ; also sheet 1
OUT3_S [morepower]: U$26.7(SRC) ; also sheet 1
V+ [morepower]: U$24.8(BATT) U$25.8(BATT) U$26.8(BATT) ; also sheet 1,2,4,5
Unconnected: U$24.3(!LBO) U$25.3(!LBO) U$26.3(!LBO)

### Notes on the sheet
- MOSFET drivers for consumers

## Library data of the parts
19V BAT0 BAT1-BAT3 M1-M4 MISC PC = con-phoenix-508:MST2V: PHOENIX
C1-C3 C13-C15 C30 C31 C35-C39 C44 C45 = rcl:CPOL-EU: POLARIZED CAPACITOR, European symbol
C4-C12 C16-C29 C32 C40-C43 C104 C113 = rcl:C-EU: CAPACITOR, European symbol
C33 C34 = SparkFun:CAP: Capacitor Standard 0603 ceramic capacitor, and 0.1" leaded capacitor.
D1 D3 = diode:BAT54C: Schottky Diodes Source: Fairchild .. BAT54.pdf
D2 D21-D23 = diode:1N5333: Z DIODE 3.3 V, 5W, 5 percent (Motorola)
D4 = diode:MBRS3*0T3: SCHOTTKY BARRIER RECTIFIER 3.0 AMPERES 20, 30, 40 VOLT Source: MBRS340T3-D.pdf
D20 = diode:DIODE-: DIODE
F1-F10 = SparkFun-PowerIC:PTC: Resettable Fuse PTC Resettable Fuse. Spark Fun Electronics SKU : COM-08357
L1 L2 = inductors:DR125: High Power Density, High Efficiency, Shielded Inductors Source: coiltronics_dr_series.pdf
LED1-LED6 PWRLED = led:LED: LED OSRAM: - CHIPLED LG R971, LG N971, LY N971, LG Q971, LY Q971, LO R971, LY R971 LH N974, LH R974 LS Q976, LO Q976, LY Q976 LO Q996 - Hyper CHIPLED LW Q18S LB Q993, LB Q99A, LB R99A - SideLED LS A670, LO A670, LY A670, LG A670, LP A670 LB A673, LV A673, LT A673, LW A673 LH A674 LY A675 LS A676, LA A676, LO A676, LY A676, LW A676 LS A679, LY A679, LG A679 - Hyper Micro SIDELED® LS Y876, LA Y876, LO Y876, LY Y876 LT Y87S - SmartLED LW L88C, LW L88S LB L89C, LB L89S, LG L890 LS L89K, LO L89K, LY L89K LS L896, LA L896, LO L896, LY L896 - TOPLED LS T670, LO T670, LY T670, LG T670, LP T670 LSG T670, LSP T670, LSY T670, LOP T670, LYG T670 LG T671, LOG T671, LSG T671 LB T673, LV T673, LT T673, LW T673 LH T674 LS T676, LA T676, LO T676, LY T676, LB T676, LH T676, LSB T676, LW T676 LB T67C, LV T67C, LT T67C, LS T67K, LO T67K, LY T67K, LW E67C LS E67B, LA E67B, LO E67B, LY E67B, LB E67C, LV E67C, LT E67C LW T67C LS T679, LY T679, LG T679 LS T770, LO T770, LY T770, LG T770, LP T770 LB T773, LV T773, LT T773, LW T773 LH T774 LS E675, LA E675, LY E675, LS T675 LS T776, LA T776, LO T776, LY T776, LB T776 LHGB T686 LT T68C, LB T68C - Hyper Mini TOPLED® LB M676 - Mini TOPLED Santana® LG M470 LS M47K, LO M47K, LY M47K Source: http://www.osram.convergy.de LUXEON: - LUMILED® LXK2-PW12-R00, LXK2-PW12-S00, LXK2-PW14-U00, LXK2-PW14-V00 LXK2-PM12-R00, LXK2-PM12-S00, LXK2-PM14-U00 LXK2-PE12-Q00, LXK2-PE12-R00, LXK2-PE12-S00, LXK2-PE14-T00, LXK2-PE14-U00 LXK2-PB12-K00, LXK2-PB12-L00, LXK2-PB12-M00, LXK2-PB14-N00, LXK2-PB14-P00, LXK2-PB14-Q00 LXK2-PR12-L00, LXK2-PR12-M00, LXK2-PR14-Q00, LXK2-PR14-R00 LXK2-PD12-Q00, LXK2-PD12-R00, LXK2-PD12-S00 LXK2-PH12-R00, LXK2-PH12-S00 LXK2-PL12-P00, LXK2-PL12-Q00, LXK2-PL12-R00 Source: www.luxeon.com KINGBRIGHT: KA-3528ASYC Source: www.kingbright.com
PAD1-PAD8 = wirepad:1,6/0,9: THROUGH-HOLE PAD
Q1-Q8 = adafruit:MOSFET-N: N-Channel Mosfet 2N7002E - 60V 260mA SOT23 [Digikey: 2N7002ET1GOSTR-ND] - REEL BSH103 - 30V 850mA SOT23 [Digikey: 568-5013-1-ND]
R1-R51 SJ100 SJ104 SJ108 SJ110 SJ114 = rcl:R-EU_: RESISTOR, European symbol
U$1-U$3 U$5-U$7 U$9 U$10 U$12 U$14 U$15 = FDMS8558S:FDMS8558S
U$4 U$8 U$11 U$13 = SparkFun-AnalogIC:ACS712: Hall-effect-based isolated linear current sensor
U$17 = tps51222:TPS51222RTVT
U$20-U$26 = MAX1614EUA:MAX1614EUA
U$27 = phoenix-1016:PC-6-16/2-G-10.16-1913646
U$105-U$108 = tonu:IRF8252
X1 = con-phoenix-3.81:1727036: MKDS 1/4-3,81 Source: http://eshop.phoenixcontact.de; MF: FARNELL; MPN: 1727036; OC_FARNELL: 3704592; OC_NEWARK: 71C4114
X2 = con-3m:2534-: 3M (TM) Pak 100 4-Wall Header Source: 3M; OC_FARNELL: unknown; OC_NEWARK: unknown
X3 X4 = con-molex:22-23-2031: .100" (2.54mm) Center Header - 3 Pin; MF: MOLEX; MPN: 22-23-2031; OC_FARNELL: 1462950; OC_NEWARK: 30C0862
X5 = con-molex:22-23-2021: .100" (2.54mm) Center Header - 2 Pin; MF: MOLEX; MPN: 22-23-2021; OC_FARNELL: 1462926; OC_NEWARK: 25C3832

## Net classes
0 default: width 0.152 mm, drill 0.3 mm, clearance 0.152 mm
1 power: width 0.508 mm, drill 0.6 mm, clearance 0.178 mm
2 morepower: width 1.016 mm, drill 0.6 mm, clearance 0.178 mm
3 gnd: width 0.305 mm, drill 0.3 mm, clearance 0.178 mm